# EAGLE design tinybee_v1 (EAGLE 7.3.0)
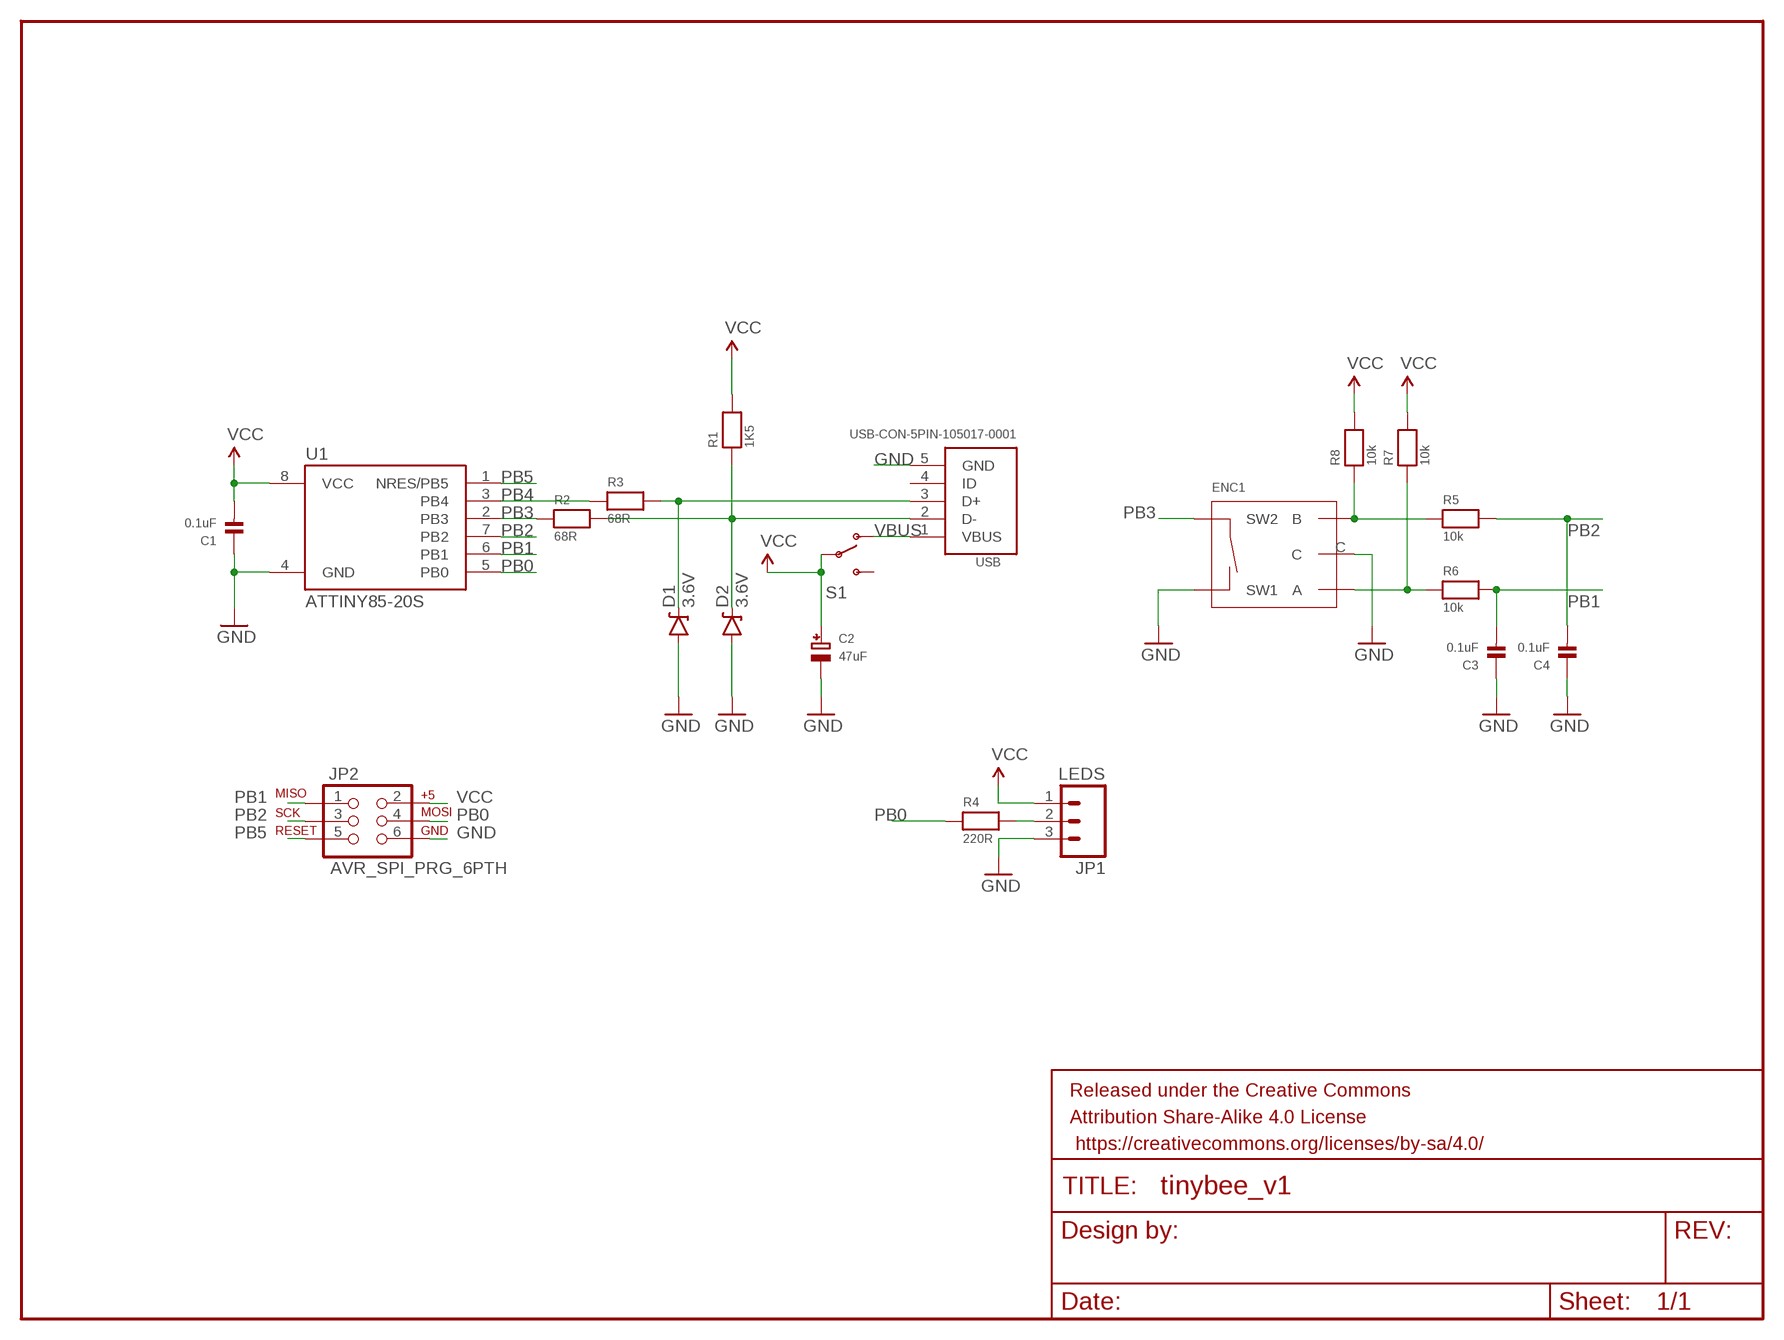
[diagram p0: schematic, sheet 1]

## Parts
C1  0.1uF  CAP_CERAMIC0603  [0603]
C2  47uF  CAP_ELECTROLYTICPANASONIC_C  [PANASONIC_C]
C3  0.1uF  CAP_CERAMIC0603  [0603]
C4  0.1uF  CAP_CERAMIC0603  [0603]
D1  3.6V  DIODE-ZENER3.3V  [SOD-323]
D2  3.6V  DIODE-ZENER3.3V  [SOD-323]
ENC1  ROTARY-ENCODER-PEC12R  [ROTARY-ENCODER-PEC12R]
FRAME1  FRAME-LETTER  [CREATIVE_COMMONS]
JP1  LEDS  M03PTH  [1X03]
JP2  AVR_SPI_PRG_6PTH  [2X3]
R1  1K5  RESISTOR0603  [0603]
R2  68R  RESISTOR0603  [0603]
R3  68R  RESISTOR0603  [0603]
R4  220R  RESISTOR0603  [0603]
R5  10k  RESISTOR0603  [0603]
R6  10k  RESISTOR0603  [0603]
R7  10k  RESISTOR0603  [0603]
R8  10k  RESISTOR0603  [0603]
S1  SWITCH-SLIDE-SPDT-RIGHTANGLE-500  [SWITCH-SPDT-RIGHTANGLE-500]
U1  ATTINY85-20S  [SOIC8_EIAJ_208MIL]
USB  USB-CON-5PIN-105017-0001  [USB-MICRO-MOLEX-105017-0001]

## Nets
GND: C1.1 C2.- C3.1 C4.1 D1.A D2.A ENC1.C ENC1.SW1 JP1.3 JP2.6 U1.4(GND) USB.5(GND)
N$2: D2.C R1.1 R2.2 USB.2(D-)
N$3: D1.C R3.2 USB.3(D+)
N$4: ENC1.A R6.1 R7.1
N$8: ENC1.B R5.1 R8.1
N$11: JP1.2 R4.2
PB0: JP2.4 R4.1 U1.5(PB0)
PB1: C3.2 JP2.1 R6.2 U1.6(PB1)
PB2: C4.2 JP2.3 R5.2 U1.7(PB2)
PB3: ENC1.SW2 R2.1 U1.2(PB3)
PB4: R3.1 U1.3(PB4)
PB5: JP2.5 U1.1(NRES/PB5)
VBUS: S1.SW1 USB.1(VBUS)
VCC: C1.2 C2.+ JP1.1 JP2.2 R1.2 R7.2 R8.2 S1.SWC(COMMON) U1.8(VCC)
Unconnected: S1.SW2 USB.4(ID)

## Library data of the parts
C1 C3 C4 = microbuilder:CAP_CERAMIC: Ceramic Capacitors 0402 - 0402 Surface Mount Capacitors 16pF 50V 5% [Digikey: 445-4899-2-ND] 18pF 50V 5% [Digikey: 490-1281-2-ND] 22pF 50V 5% [Digikey: 490-1283-2-ND] 68pF 50V 5% [Digikey: 490-1289-2-ND] 0.1uF 10V 10% [Digikey: 490-1318-2-ND] 1.0uF 6.3V 10% [Digikey: 490-1320-2-ND] 0603 - 0603 Surface Mount Capacitors 16 pF 50V 5% [Digikey: 445-5051-2-ND] 22 pF 50V [Digikey: PCC220ACVTR-ND] 33 pF 50V 5% [Digikey: 490-1415-1-ND] 56pF 50V 5% [Digikey: 490-1421-1-ND] 220pF 50V 5% [Digikey: 445-1285-1-ND] 680 pF 50V 2200 pF 50V 5% C0G [Digikey: 445-1297-1-ND] 5600 pF 100V 5% X7R [Digikey: 478-3711-1-ND] 0.1 µF 25V 10% [Digikey: PCC2277TR-ND] 0.22 µF 16V 10% X7R [Digikey: 445-1318-1-ND] 1.0 µF 25V 10% [Digikey: 445-5146-2-ND] 0603 - RF Specific 3pF 250V +/-0.1pF RF [Digikey: 712-1347-1-ND] 18 pF 250V 5% [Digikey: 478-3505-1-ND or 712-1322-1-ND] 56 pF 250V 5% C0G RF [Digikey: 490-4867-1-ND] 68 pF 250V RF [Digikey: 490-4868-1-ND] 0805 - 0805 Surface Mount Capacitors 220 pF 250V 2% RF Ceramic Capacitor [Digikey: 712-1398-1-ND] 1000 pF 50V 2% NP0 Ceramic Capacitor [Digikey: 478-3760-1-ND] 0.1 µF 25V 10% Ceramic Capacitor [Digikey: PCC1828TR-ND] 1.0 µF 16V 10% Ceramic Capacitor[Digikey: 490-1691-2-ND] 10.0 µF 10V 10% Ceramic Capacitor[Digikey: 709-1228-1-ND] 10.0 uF 16V 10% Ceramic Capacitor [Digikey: 478-5165-2-ND] 47 uF 6.3V 20% Ceramic Capacitor [Digikey: 587-1779-1-ND or 399-5506-1-ND] 1206 - 1206 Surface Mount Capacitors 47uF 10V 20% Ceramic Capacitor [Digikey: 490-5528-1-ND or 399-5508-1-ND or 445-6010-1-ND] 100uF 6.3V -20%, +80% Y5V Ceramic Capacitor (Digikey: 490-4512-1-ND, Mouser: 81-GRM31CF50J107ZE1L)
C2 = microbuilder:CAP_ELECTROLYTIC: Electrolytic Capacitors SMT PANASONIC_C - Size C Panasonic Electrolytic Aluminum Capacitor 47µF 16V 20% Electrolytic Capacitor [Digikey: PCE3890TR-ND] PANASONIC_D - Size D Panasonic Electrolytic Aluminum Capacitor 100µF 25V 20% Electrolytic Capacitor [Digikey: PCE3898TR-ND] PTH 3.5 mm grid, 8 mm diameter ... 3.5 mm grid, 10 mm diameter ...
D1 D2 = SparkFun-DiscreteSemi:DIODE-ZENER: Zener Diode Production Part - 8199 3.4V Zener Voltage; PROD_ID: DIO-11284; VALUE: 3.3V
ENC1 = Custom:ROTARY-ENCODER-PEC12R
FRAME1 = SparkFun-Aesthetics:FRAME-LETTER: Schematic Frame Standard 8.5x11 US Letter frame
JP1 = SparkFun-Connectors:M03: Header 3 Standard 3-pin 0.1" header. Use with straight break away headers (SKU : PRT-00116), right angle break away headers (PRT-00553), swiss pins (PRT-00743), machine pins (PRT-00117), and female headers (PRT-00115). Molex polarized connector foot print use with SKU : PRT-08232 with associated crimp pins and housings.
JP2 = SparkFun-Connectors:AVR_SPI_PRG_6: AVR ISP 6 Pin This is the reduced ISP connector for AVR programming. Common on Arduino. This footprint will take up less PCB space and can be used with a 10-pin to 6-pin adapter such as SKU: BOB-08508 **Special note about "TEST_POINT" package. The stop mask is on the top side, so if you want your programming test points to be on the bottom of your board, make sure to place this package on the bottom side of the board. This also ensure that the orientation to program from the bottom side will be correct.
R1-R8 = microbuilder:RESISTOR: Resistors 0402 - 0402 Surface Mount Package 22 Ohm 1% 1/16W [Digikey: 311-22.0LRTR-ND] 33 Ohm 5% 1/16W 1.0K 5% 1/16W 1.5K 5% 1/16W 2.0K 1% 1/16W 10.0K 1% 1/16W [Digikey: 311-10.0KLRTR-ND] 10.0K 5% 1/16W [Digikey: RMCF0402JT10K0TR-ND] 12.1K 1% 1/16W [Digikey: 311-22.0LRTR-ND] 100.0K 5% 1/16W 0603 - 0603 Surface Mount Package 0 Ohm 1/10 Watt 1% Resistor 15 Ohm 1/10 Watt 1% Resistor 33 Ohm 1/10 Watt 1% Resistor 49.9 Ohm 1/10 Watt 1% Resistor 100 Ohm 1/10 Watt 1% Resistor 150 Ohm 1/10 Watt 1% Resistor 240 Ohm 1/10 Watt 1% Resistor 390 Ohm 1/10 Watt 1% Resistor 560 Ohm 1/10 Watt 1% Resistor 680 Ohm 1/10 Watt 1% Resistor 750 Ohm 1/10 Watt 1% Resistor 1.0K Ohm 1/10 Watt 1% Resistor 1.5K Ohm 1/10 Watt 1% Resistor 2.0K Ohm 1/10 Watt 1% Resistor 2.2K Ohm 1/10 Watt 1% Resistor 3.3K Ohm 1/10 Watt 1% Resistor 4.7K Ohm 1/10 Watt 1% Resistor 10.0K Ohm 1/10 Watt 1% Resistor 12.0K Ohm 1/10 Watt 1% Resistor 12.1K Ohm 1/10 Watt 1% Resistor 20.0K Ohm 1/10 Watt 1% Resistor 33.0K Ohm 1/10 Watt 1% Resistor 100.0K Ohm 1/10 Watt 1% Resistor 0805 - 0805 Surface Mount Package 0 Ohm 1/8 Watt 1% Resistor 33 Ohm 1/8 Watt 1% Resistor 100 Ohm 1/8 Watt 1% Resistor 150 Ohm 1/8 Watt 1% Resistor 200 Ohm 1/8 Watt 1% Resistor 240 Ohm 1/8 Watt 1% Resistor 330 Ohm 1/8 Watt 1% Resistor 390 Ohm 1/8 Watt 1% Resistor 470 Ohm 1/8 Watt 1% Resistor 1.0K Ohm 1/8 Watt 1% Resistor 1.5K Ohm 1/8 Watt 1% Resistor 2.0K Ohm 1/8 Watt 1% Resistor 4.7K Ohm 1/8 Watt 1% Resistor 5.1K Ohm 1/8 Watt 1% Resistor 5.6K Ohm 1/8 Watt 1% Resistor 10.0K Ohm 1/8 Watt 1% Resistor 22.0K Ohm 1/8 Watt 1% Resistor 33.0K Ohm 1/8 Watt 1% Resistor 100K Ohm 1/8 Watt 1% Resistor 1206 - 1206 Surface Mount Package 2012 - 2010 Surface Mount Package 0.11 Ohm 1/2 Watt 1% Resistor - Digikey: RHM.11UCT-ND
S1 = Custom:SWITCH-SLIDE-SPDT-RIGHTANGLE-500: https://www.e-switch.com/system/asset/product_line/data_sheet/115/500.pdf
U1 = _hhn_attiny25_45_85:ATTINY85*: ATMEL ATtiny 85 Packages: P = PDIP 08 30mil S = SOIC 08 EIAJ 208mil Technologies Note: for complete ordering code (temp. range, finish, tape&reel etc.) see www.atmel.com • Supply Voltage: V = (1.8…5.5)V | [blank] = (2.7…5.5)V • Speed: 10 = 10 MHz | 20 = 20 MHz Author: Dipl.-Ing. FH Rainer Bayer HHN Hochschule Heilbronn (Heilbronn University), rainer.bayer@hs-heilbronn.de Ingenieurbüro ing-rb, mail@ing-rb.de
USB = GeekAmmo:USB-CON-5PIN: Molex Micro USB 105017-0001

## Board
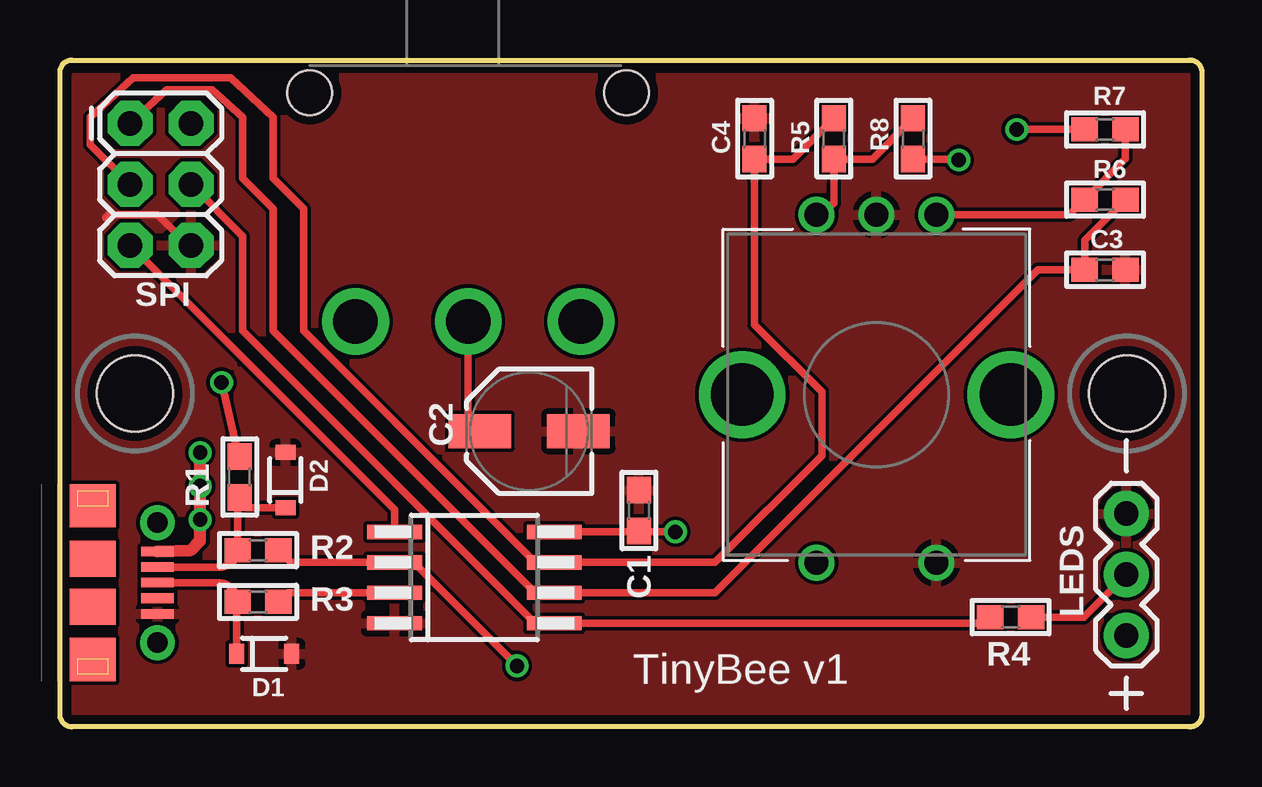
[diagram p1: board, top side]
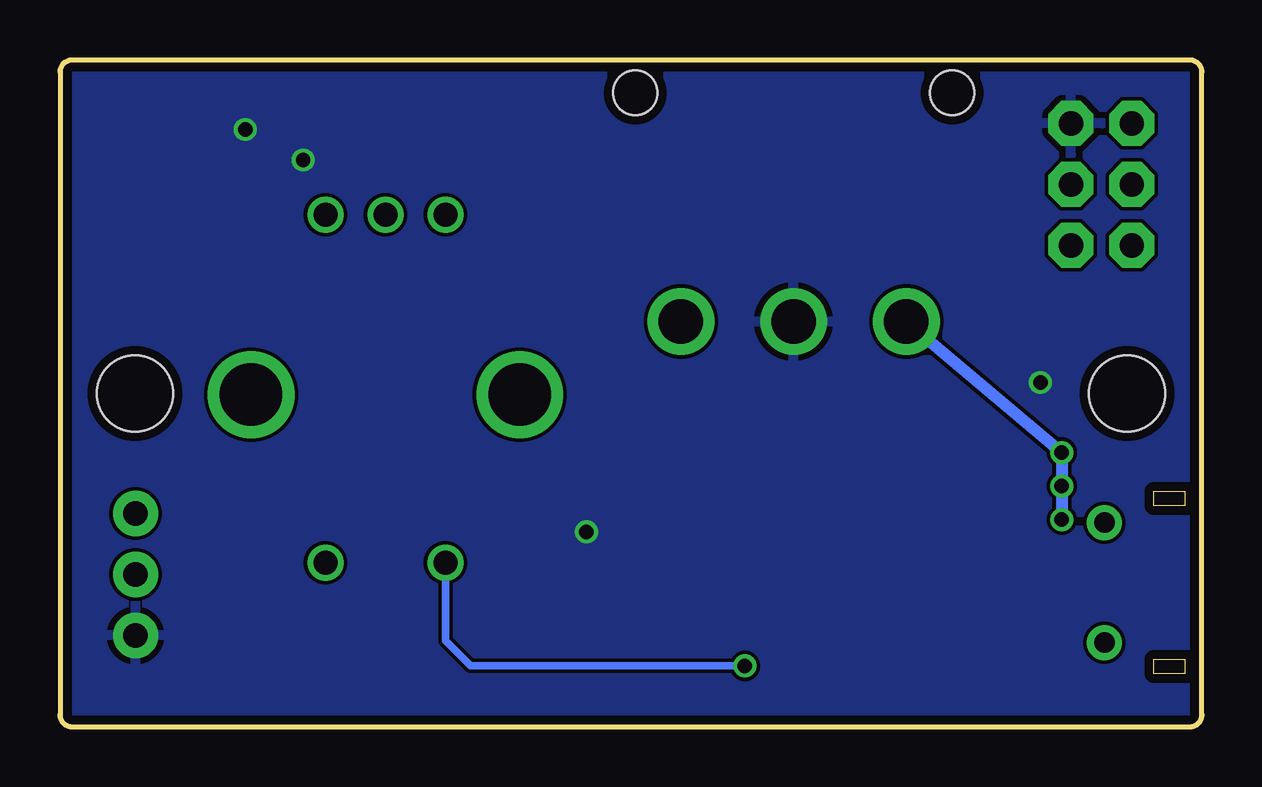
[diagram p2: board, bottom side, seen from below]

Size 47.6 x 27.79 mm. Coordinates in mm from the lower left corner, seen from the top.
Copper layers (1*16): Top 0.0356mm / dielectric 1.5011mm / Bottom 0.0356mm
Design rules "oshpark-2layer": minimum track width 6mil, minimum drill 13mil, track to track 6mil, track to pad 6mil, pad to pad 6mil, via to via 6mil, smd to smd 6mil, copper to edge 15mil, drill to drill 6mil, minimum pad ring 7mil, minimum via ring 7mil, stop-mask expansion 4mil, vias tented up to drill 0mil, thermal gap 10mil

### Footprints (pad centres in the part's own frame; a part is rotated, then mirrored left to right if it is on the bottom)
0603 = smd 1.1 x 1: 1 -0.85,0; 2 0.85,0
PANASONIC_C = smd 2.6 x 1.4: + 2.05,0; - -2.05,0
SOD-323 = smd 0.63 x 0.83: A 1.15,0; C -1.15,0
ROTARY-ENCODER-PEC12R = drill 1: A -2.5,-7.5; B 2.5,-7.5; C 0,-7.5; SW1 -2.5,7; SW2 2.5,7 | drill 2.6: P$1 -5.6,0; P$2 5.6,0
1X03 = drill 1.016 pad 1.88: 1 0,0; 2 2.54,0; 3 5.08,0
2X3 = drill 1.016 pad 1.88 octagon: 1 0,0; 2 0,2.54; 3 2.54,0; 4 2.54,2.54; 5 5.08,0; 6 5.08,2.54
SWITCH-SPDT-RIGHTANGLE-500 = drill 1.854: SW1 -4.699,0; SW2 4.699,0; SWC 0,0 | hole 1.854: -6.604,9.525; 6.604,9.525
SOIC8_EIAJ_208MIL = smd 0.6 x 2.286: 1 -1.905,-3.33; 2 -0.635,-3.33; 3 0.635,-3.33; 4 1.905,-3.33; 5 1.905,3.33; 6 0.635,3.33; 7 -0.635,3.33; 8 -1.905,3.33
FB-30 = hole 3.175: 3.124,13.894; 44.475,13.894
USB-MICRO-MOLEX-105017-0001 = smd 0.4 x 1.35: 1 1.2,0; 2 1.85,0; 3 2.5,0; 4 3.15,0; 5 3.8,0 | drill 0.85 pad 1.45: P$1 0,0; P$2 5,0 | smd 1.5 x 1.9: P$3 3.5,-2.7; P$4 1.5,-2.7 | smd 1.8 x 1.9: P$5 -0.7,-2.7; P$6 5.7,-2.7

### Placement (x,y rotation side)
C1  24.13,9.02 270 top
C2  19.56,12.32 180 top
C3  43.56,19.05 180 top
C4  28.96,24.51 270 top
D1  8.51,3.05 0 top
D2  9.4,10.29 90 top
ENC1  34.04,13.84 180 top
FRAME1  -101.6,35.56 0 top  (outside the outline)
JP1  44.45,3.81 90 top
JP2  2.92,25.15 270 top
R1  7.49,10.41 90 top
R2  8.26,7.37 180 top
R3  8.26,5.21 180 top
R4  39.62,4.57 0 top
R5  32.26,24.51 90 top
R6  43.56,21.97 0 top
R7  43.56,24.89 180 top
R8  35.56,24.51 270 top
S1  17.02,16.89 0 top
U1  17.27,6.22 270 top
U$1  [FB-30]  0,0 0 top
USB  4.06,8.51 270 top

### Tracks (layer width: path | path; a pad name or v marks a point on that pad's centre or on a via)
GND
  Top 0.305: JP2.6 5.33,20.07 4.06,21.34 2.03,21.34 1.91,21.21
  pour Top: 0.64,27.05 46.99,27.05 46.99,0.51 0.64,0.51
N$2
  Top 0.305: USB.2 6.7,6.66 arc90 R2.2 7.41,9.53 R1.1 7.79,9.14 D2.C
N$3
  Top 0.305: USB.3 6.6,6.01 arc-90 R3.2 7.36,5.16 D1.C
N$4
  Top 0.305: R7.1 44.41,23.67 R6.1 42.08,21.34 ENC1.A
N$8
  Top 0.305: R8.1 33.86,23.66 R5.1 32.26,21.81 ENC1.B
N$11
  Top 0.305: R4.2 42.67,4.57 JP1.2
PB0
  Top 0.305: JP2.4 7.62,20.45 7.62,16.51 19.81,4.32 U1.5 38.52,4.32 R4.1
PB1
  Top 0.305: JP2.1 4.45,26.54 6.35,26.54 7.62,25.4 7.62,22.86 8.89,21.59 8.89,16.51 19.81,5.59 U1.6 27.3,5.59 40.77,19.05 C3.2 42.71,20.27 R6.2
PB2
  Top 0.305: JP2.3 1.27,24.26 1.27,25.4 3.05,27.05 7.11,27.05 8.89,25.4 8.89,22.86 10.16,21.59 10.16,16.51 19.81,6.86 U1.7 27.3,6.86 31.75,11.3 31.75,13.97 28.96,16.76 C4.2 30.56,23.66 R5.2
PB3  (via drill 0.6)
  Top 0.305: R2.1 9.61,6.86 U1.2 14.73,6.86 v19.05,2.54
  Bottom 0.305: ENC1.SW2 31.54,3.6 30.48,2.54 v19.05,2.54
PB4
  Top 0.305: U1.3 9.49,5.59 R3.1
PB5
  Top 0.305: U1.1 13.94,9.04 JP2.5
VBUS  (via drill 0.6)
  Top 0.508: USB.1 5.46,7.37 5.84,7.75 v5.84,8.64 v5.84,10.03 v5.84,11.43
  Bottom 0.508: S1.SW1 v5.84,11.43 v5.84,10.03 v5.84,8.64
VCC  (via drill 0.6)
  Top 0.305: S1.SWC 17.02,12.81 C2.+ | 24.09,8.13 v25.65,8.13 | U1.8 24.09,8.13 | 24.09,8.13 C1.2 | R1.2 7.45,11.26 v6.73,14.35 | R8.2 37.43,23.66 v37.47,23.62 | R7.2 v39.88,24.89
  Bottom 0.305: v25.65,8.13 25.91,8.13
  pour Bottom: 0.64,27.18 46.99,27.18 46.99,0.51 0.64,0.51

### Text on the board
tPlace: R7 | C4 | R5 | R8 | R6 | C3 | SPI | C2 | D2 | R1 | R2 | R3 | C1 | LEDS | R4 | TinyBee v1 | D1